# Altium schematic sheet CSI_FLAT.SchDoc: CSI FLAT
size A4; Author: Silvio Navaretti; CompanyName: Arduino SRL; DrawnBy: Silvio Navaretti; Engineer: Silvio Navaretti; Organization: Arduino SRL; DocumentNumber: ASX00083; SheetNumber: 6; SheetTotal: 11; RevAuthor: Silvio Navaretti
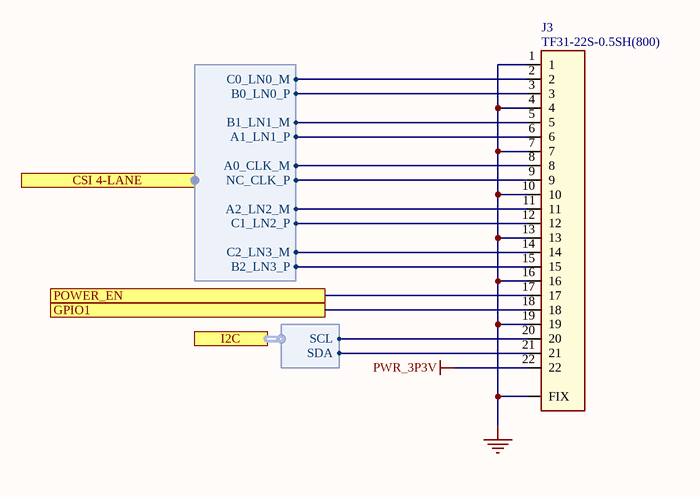
[diagram p0: CSI_FLAT.SchDoc]

## Parts
J3  TF31-22S-0.5SH(800)  [TF31-22S-0.5SH(800)]

## Ports
CSI 4-LANE (harness IMOLA_CSI), GPIO1, I2C (harness I2C), POWER_EN

## Harnesses
I2C: SDA, SCL
IMOLA_CSI: C2_LN3_M, A2_LN2_M, C1_LN2_P, C0_LN0_M, B0_LN0_P, A0_CLK_M, NC_CLK_P, B1_LN1_M, A1_LN1_P, B2_LN3_P

## Nets
GND: J3.1 J3.4 J3.7 J3.10 J3.13 J3.16 J3.19 J3.FIX
PWR_3P3V: J3.22
GPIO1: J3.18 ; port GPIO1
POWER_EN: J3.17 ; port POWER_EN
NetJ3_2: J3.2 ; port CSI 4-LANE.C0_LN0_M
NetJ3_3: J3.3 ; port CSI 4-LANE.B0_LN0_P
NetJ3_5: J3.5 ; port CSI 4-LANE.B1_LN1_M
NetJ3_6: J3.6 ; port CSI 4-LANE.A1_LN1_P
NetJ3_8: J3.8 ; port CSI 4-LANE.A0_CLK_M
NetJ3_9: J3.9 ; port CSI 4-LANE.NC_CLK_P
NetJ3_11: J3.11 ; port CSI 4-LANE.A2_LN2_M
NetJ3_12: J3.12 ; port CSI 4-LANE.C1_LN2_P
NetJ3_14: J3.14 ; port CSI 4-LANE.C2_LN3_M
NetJ3_15: J3.15 ; port CSI 4-LANE.B2_LN3_P
NetJ3_20: J3.20 ; port I2C.SCL
NetJ3_21: J3.21 ; port I2C.SDA

## Notes on the sheet
- Title:
- ID:
- Date:
- Time:
- Version:
- Sheet
- of
- RevAuthor:
- Reference Designs ARE PROVIDED "AS IS" AND "WITH ALL FAULTS. Arduino SA DISCLAIMS ALL OTHER WARRANTIES, EXPRESS OR IMPLIED, REGARDING PRODUCTS, INCLUDING BUT NOT LIMITED TO, ANY IMPLIED WARRANTIES OF MERCHANTABILITY OR FITNESS FOR A PARTICULAR PURPOSE.
  Arduino SA may make changes to specifications and product descriptions at any time, without notice. The Customer must not rely on the absence or characteristics of any features or instructions marked "reserved" or "undefined". Arduino SA reserves these for future definition and shall have no responsibility whatsoever for conflicts or incompatibilities arising from future changes to them. The product information on the Web Site or Materials is subject to change without notice.
  Do not finalize a design with this info. ARDUINO and other Arduino brands and logos and Trademarks of Arduino SA. All Arduino SA Trademarks cannot be used without owner's formal permission.
- File:
- Author:

## Library data of the parts
J3 = J0553-A.2: CONN FFC/FPC Connector, 22 Contact(s), 1 Row(s), BOTTOM CONTACT, Female, Right Angle, 0.5mm Pitch; Manufacturer: Hirose; Code Arduino: J0553; Part Number: TF31-22S-0.5SH(800)